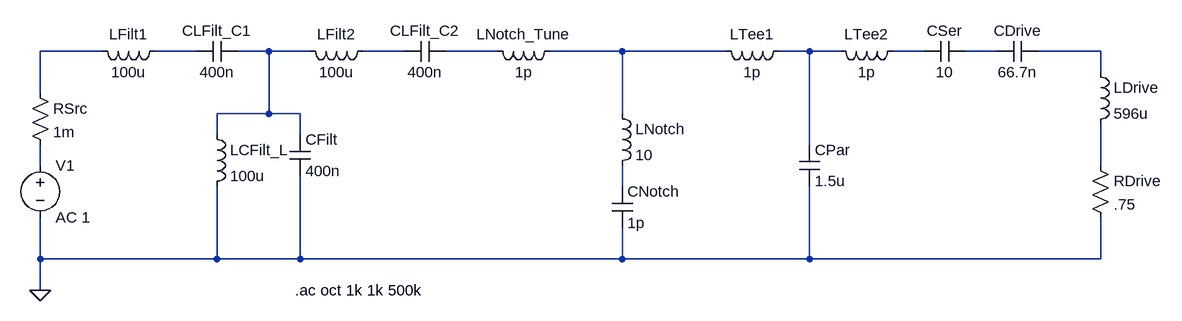
[diagram p0: schematic Filter_Archetype_1.asc]
Filter_Archetype_1.asc, the LTspice schematic file:
Version 4
SHEET 1 1604 680
WIRE -32 64 -128 64
WIRE 112 64 48 64
WIRE 224 64 176 64
WIRE 288 64 224 64
WIRE 432 64 368 64
WIRE 576 64 496 64
WIRE 768 64 656 64
WIRE 928 64 768 64
WIRE 1056 64 1008 64
WIRE 1104 64 1056 64
WIRE 1232 64 1184 64
WIRE 1344 64 1296 64
WIRE 1504 64 1408 64
WIRE 1504 96 1504 64
WIRE -128 128 -128 64
WIRE 224 160 224 64
WIRE 224 160 144 160
WIRE 272 160 224 160
WIRE 768 160 768 64
WIRE 144 192 144 160
WIRE 272 192 272 160
WIRE 1056 208 1056 64
WIRE -128 240 -128 208
WIRE 1504 240 1504 176
WIRE 768 272 768 240
WIRE -128 384 -128 320
WIRE 144 384 144 272
WIRE 144 384 -128 384
WIRE 272 384 272 256
WIRE 272 384 144 384
WIRE 768 384 768 336
WIRE 768 384 272 384
WIRE 1056 384 1056 272
WIRE 1056 384 768 384
WIRE 1504 384 1504 320
WIRE 1504 384 1056 384
WIRE -128 432 -128 384
FLAG -128 432 0
SYMBOL voltage -128 224 R0
WINDOW 123 0 0 Left 0
WINDOW 39 0 0 Left 0
SYMATTR InstName V1
SYMATTR Value AC 1
SYMBOL ind 64 48 R90
WINDOW 0 5 56 VBottom 2
WINDOW 3 32 56 VTop 2
SYMATTR InstName LFilt1
SYMATTR Value 100u
SYMATTR SpiceLine Rser=100m
SYMBOL cap 176 48 R90
WINDOW 0 0 32 VBottom 2
WINDOW 3 32 32 VTop 2
SYMATTR InstName CLFilt_C1
SYMATTR Value 400n
SYMBOL res -144 112 R0
SYMATTR InstName RSrc
SYMATTR Value 1m
SYMBOL ind 384 48 R90
WINDOW 0 5 56 VBottom 2
WINDOW 3 32 56 VTop 2
SYMATTR InstName LFilt2
SYMATTR Value 100u
SYMATTR SpiceLine Rser=100m
SYMBOL cap 496 48 R90
WINDOW 0 0 32 VBottom 2
WINDOW 3 32 32 VTop 2
SYMATTR InstName CLFilt_C2
SYMATTR Value 400n
SYMBOL ind 128 176 R0
SYMATTR InstName LCFilt_L
SYMATTR Value 100u
SYMATTR SpiceLine Rser=100m
SYMBOL cap 256 192 R0
SYMATTR InstName CFilt
SYMATTR Value 400n
SYMBOL ind 752 144 R0
SYMATTR InstName LNotch
SYMATTR Value 10
SYMBOL cap 752 272 R0
SYMATTR InstName CNotch
SYMATTR Value 1p
SYMBOL ind 672 48 R90
WINDOW 0 5 56 VBottom 2
WINDOW 3 32 56 VTop 2
SYMATTR InstName LNotch_Tune
SYMATTR Value 1p
SYMBOL ind 1024 48 R90
WINDOW 0 5 56 VBottom 2
WINDOW 3 32 56 VTop 2
SYMATTR InstName LTee1
SYMATTR Value 1p
SYMBOL ind 1200 48 R90
WINDOW 0 5 56 VBottom 2
WINDOW 3 32 56 VTop 2
SYMATTR InstName LTee2
SYMATTR Value 1p
SYMBOL cap 1040 208 R0
SYMATTR InstName CPar
SYMATTR Value 1.5u
SYMBOL cap 1296 48 R90
WINDOW 0 0 32 VBottom 2
WINDOW 3 32 32 VTop 2
SYMATTR InstName CSer
SYMATTR Value 10
SYMBOL cap 1408 48 R90
WINDOW 0 0 32 VBottom 2
WINDOW 3 32 32 VTop 2
SYMATTR InstName CDrive
SYMATTR Value 66.7n
SYMBOL ind 1488 80 R0
SYMATTR InstName LDrive
SYMATTR Value 596u
SYMBOL res 1488 224 R0
SYMATTR InstName RDrive
SYMATTR Value .75
TEXT 264 432 Left 2 !.ac oct 1k 1k 500k

The netlist it stands for:
* Filter_Archetype_1.asc
V1 N011 0 AC 1
LFilt1 N002 N001 100u Rser=100m
CLFilt_C1 N003 N002 400n
RSrc N001 N011 1m
LFilt2 N004 N003 100u Rser=100m
CLFilt_C2 N005 N004 400n
LCFilt_L N003 0 100u Rser=100m
CFilt N003 0 400n
LNotch N006 N013 10
CNotch N013 0 1p
LNotch_Tune N006 N005 1p
LTee1 N007 N006 1p
LTee2 N008 N007 1p
CPar N007 0 1.5u
CSer N009 N008 10
CDrive N010 N009 66.7n
LDrive N010 N012 596u
RDrive N012 0 .75
.ac oct 1k 1k 500k
.backanno
.end